# EAGLE schematic Arduino-mini-328-Sch (EAGLE 7.1.0)
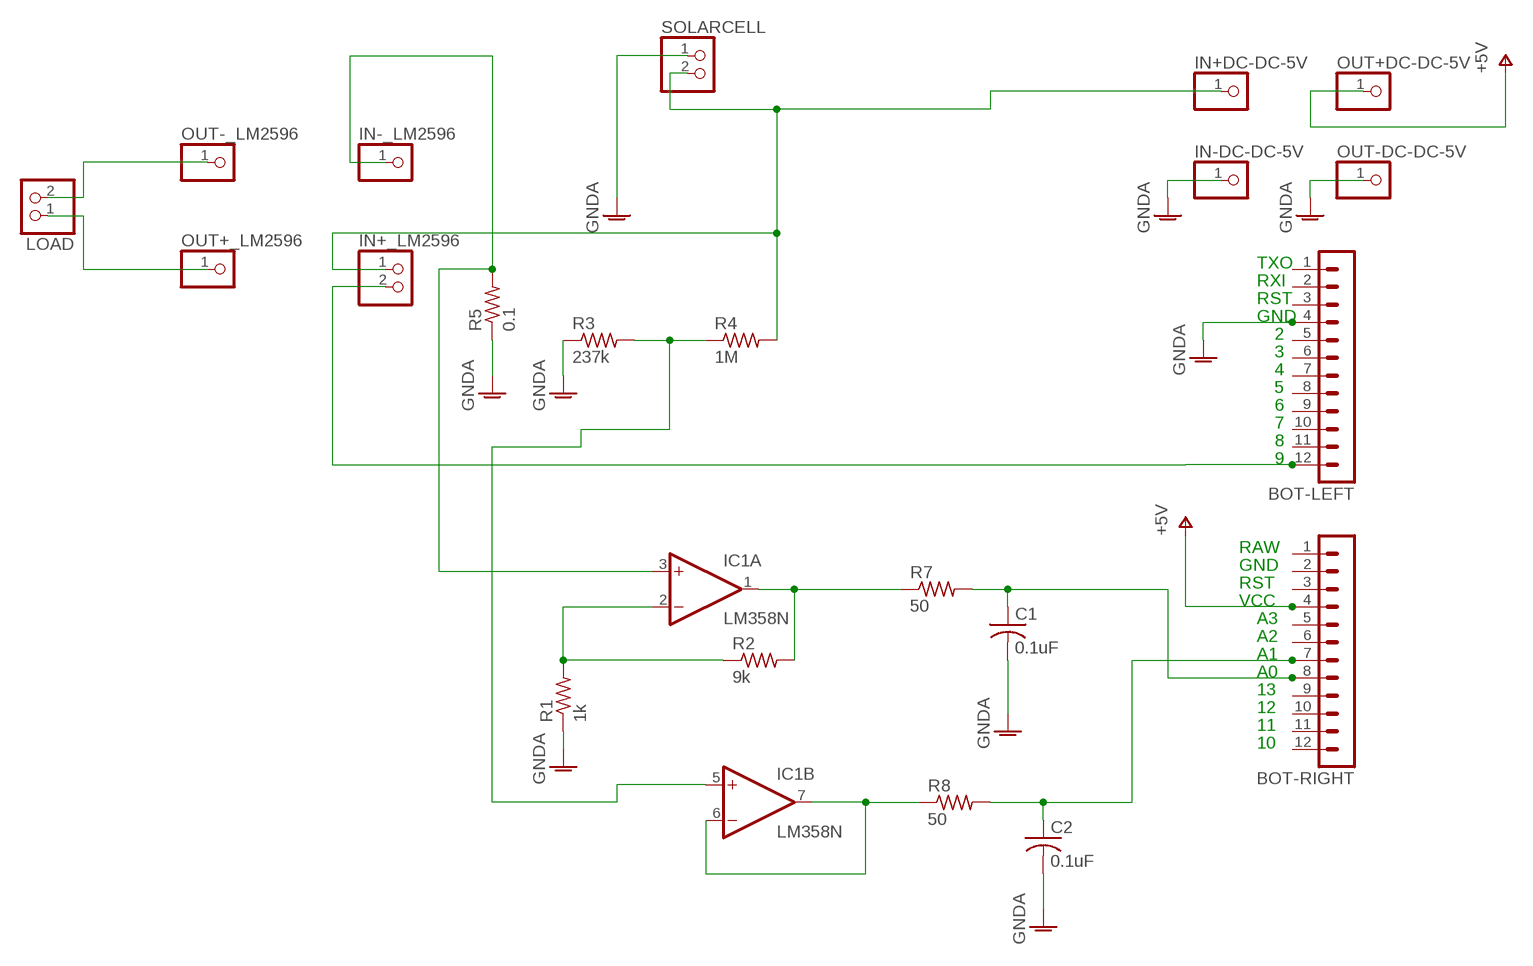
[diagram p0: schematic, sheet 1]

## Parts
BOT-LEFT  MA12-1  [MA12-1]
BOT-RIGHT  MA12-1  [MA12-1]
C1  0.1uF  C-US025-030X050  [C025-030X050]
C2  0.1uF  C-US025-030X050  [C025-030X050]
IC1  LM358N  [DIL08]
IN+_LM2596  PINHD-1X2/90  [1X02/90]
IN+DC-DC-5V  PINHD-1X1  [1X01]
IN-_LM2596  PINHD-1X1  [1X01]
IN-DC-DC-5V  PINHD-1X1  [1X01]
LOAD  PINHD-1X2  [1X02]
OUT+_LM2596  PINHD-1X1  [1X01]
OUT+DC-DC-5V  PINHD-1X1  [1X01]
OUT-_LM2596  PINHD-1X1  [1X01]
OUT-DC-DC-5V  PINHD-1X1  [1X01]
R1  1k  R-US_0207/10  [0207/10]
R2  9k  R-US_0207/10  [0207/10]
R3  237k  R-US_0207/10  [0207/10]
R4  1M  R-US_0207/10  [0207/10]
R5  0.1  R-US_0207/10  [0207/10]
R7  50  R-US_0207/10  [0207/10]
R8  50  R-US_0207/10  [0207/10]
SOLARCELL  PINHD-1X2  [1X02]

## Nets
GNDA: BOT-LEFT.4 C1.2 C2.2 IN-DC-DC-5V.1 OUT-DC-DC-5V.1 R1.1 R3.1 R5.1 SOLARCELL.1
N$1: IC1.1(A:OUT) R2.2 R7.1
N$2: IC1.2(A:-IN) R1.2 R2.1
N$3: BOT-LEFT.12 IN+_LM2596.2
N$5: IC1.6(B:-IN) IC1.7(B:OUT) R8.1
N$6: IC1.3(A:+IN) IN-_LM2596.1 R5.2
N$7: BOT-RIGHT.8 C1.1 R7.2
N$8: BOT-RIGHT.7 C2.1 R8.2
N$10: IN+_LM2596.1 IN+DC-DC-5V.1 R4.2 SOLARCELL.2
N$11: IC1.5(B:+IN) R3.2 R4.1
N$12: LOAD.2 OUT-_LM2596.1
N$13: LOAD.1 OUT+_LM2596.1
V+: BOT-RIGHT.4 OUT+DC-DC-5V.1 ; supply symbol labelled +5V
Unconnected: BOT-LEFT.1 BOT-LEFT.2 BOT-LEFT.3 BOT-LEFT.5 BOT-LEFT.6 BOT-LEFT.7 BOT-LEFT.8 BOT-LEFT.9 BOT-LEFT.10 BOT-LEFT.11 BOT-RIGHT.1 BOT-RIGHT.2 BOT-RIGHT.3 BOT-RIGHT.5 BOT-RIGHT.6 BOT-RIGHT.9 BOT-RIGHT.10 BOT-RIGHT.11 BOT-RIGHT.12

## Notes on the sheet
- TXO
- RXI
- RST
- GND
- 2
- 3
- 4
- 5
- 6
- 7
- 8
- 9
- RAW
- GND
- RST
- VCC
- A3
- A2
- A1
- A0
- 13
- 12
- 11
- 10

## Power pins joined to a net without a drawn wire
V+: IC1.8(P:V+)
V-: IC1.4(P:V-)

## Library data of the parts
BOT-LEFT BOT-RIGHT = con-lstb:MA12-1: PIN HEADER; OC_FARNELL: unknown; OC_NEWARK: unknown
C1 C2 = adafruit:C-US: CAPACITOR, American symbol
IC1 = linear:LM358: OP AMP also LM158; LM258; LM2904 Source: http://cache.national.com/ds/LM/LM158.pdf
IN+_LM2596 LOAD SOLARCELL = pinhead:PINHD-1X2: PIN HEADER
IN+DC-DC-5V IN-_LM2596 IN-DC-DC-5V OUT+_LM2596 OUT+DC-DC-5V OUT-_LM2596 OUT-DC-DC-5V = pinhead:PINHD-1X1: PIN HEADER
R1-R5 R7 R8 = resistor:R-US_: RESISTOR, American symbol